# Altium schematic sheet S05.SchDoc: IEEE-1394/Ethernet FPGA Controller
size 381 x 254 mm; Revision: 3.2; SheetNumber: 5; SheetTotal: 10
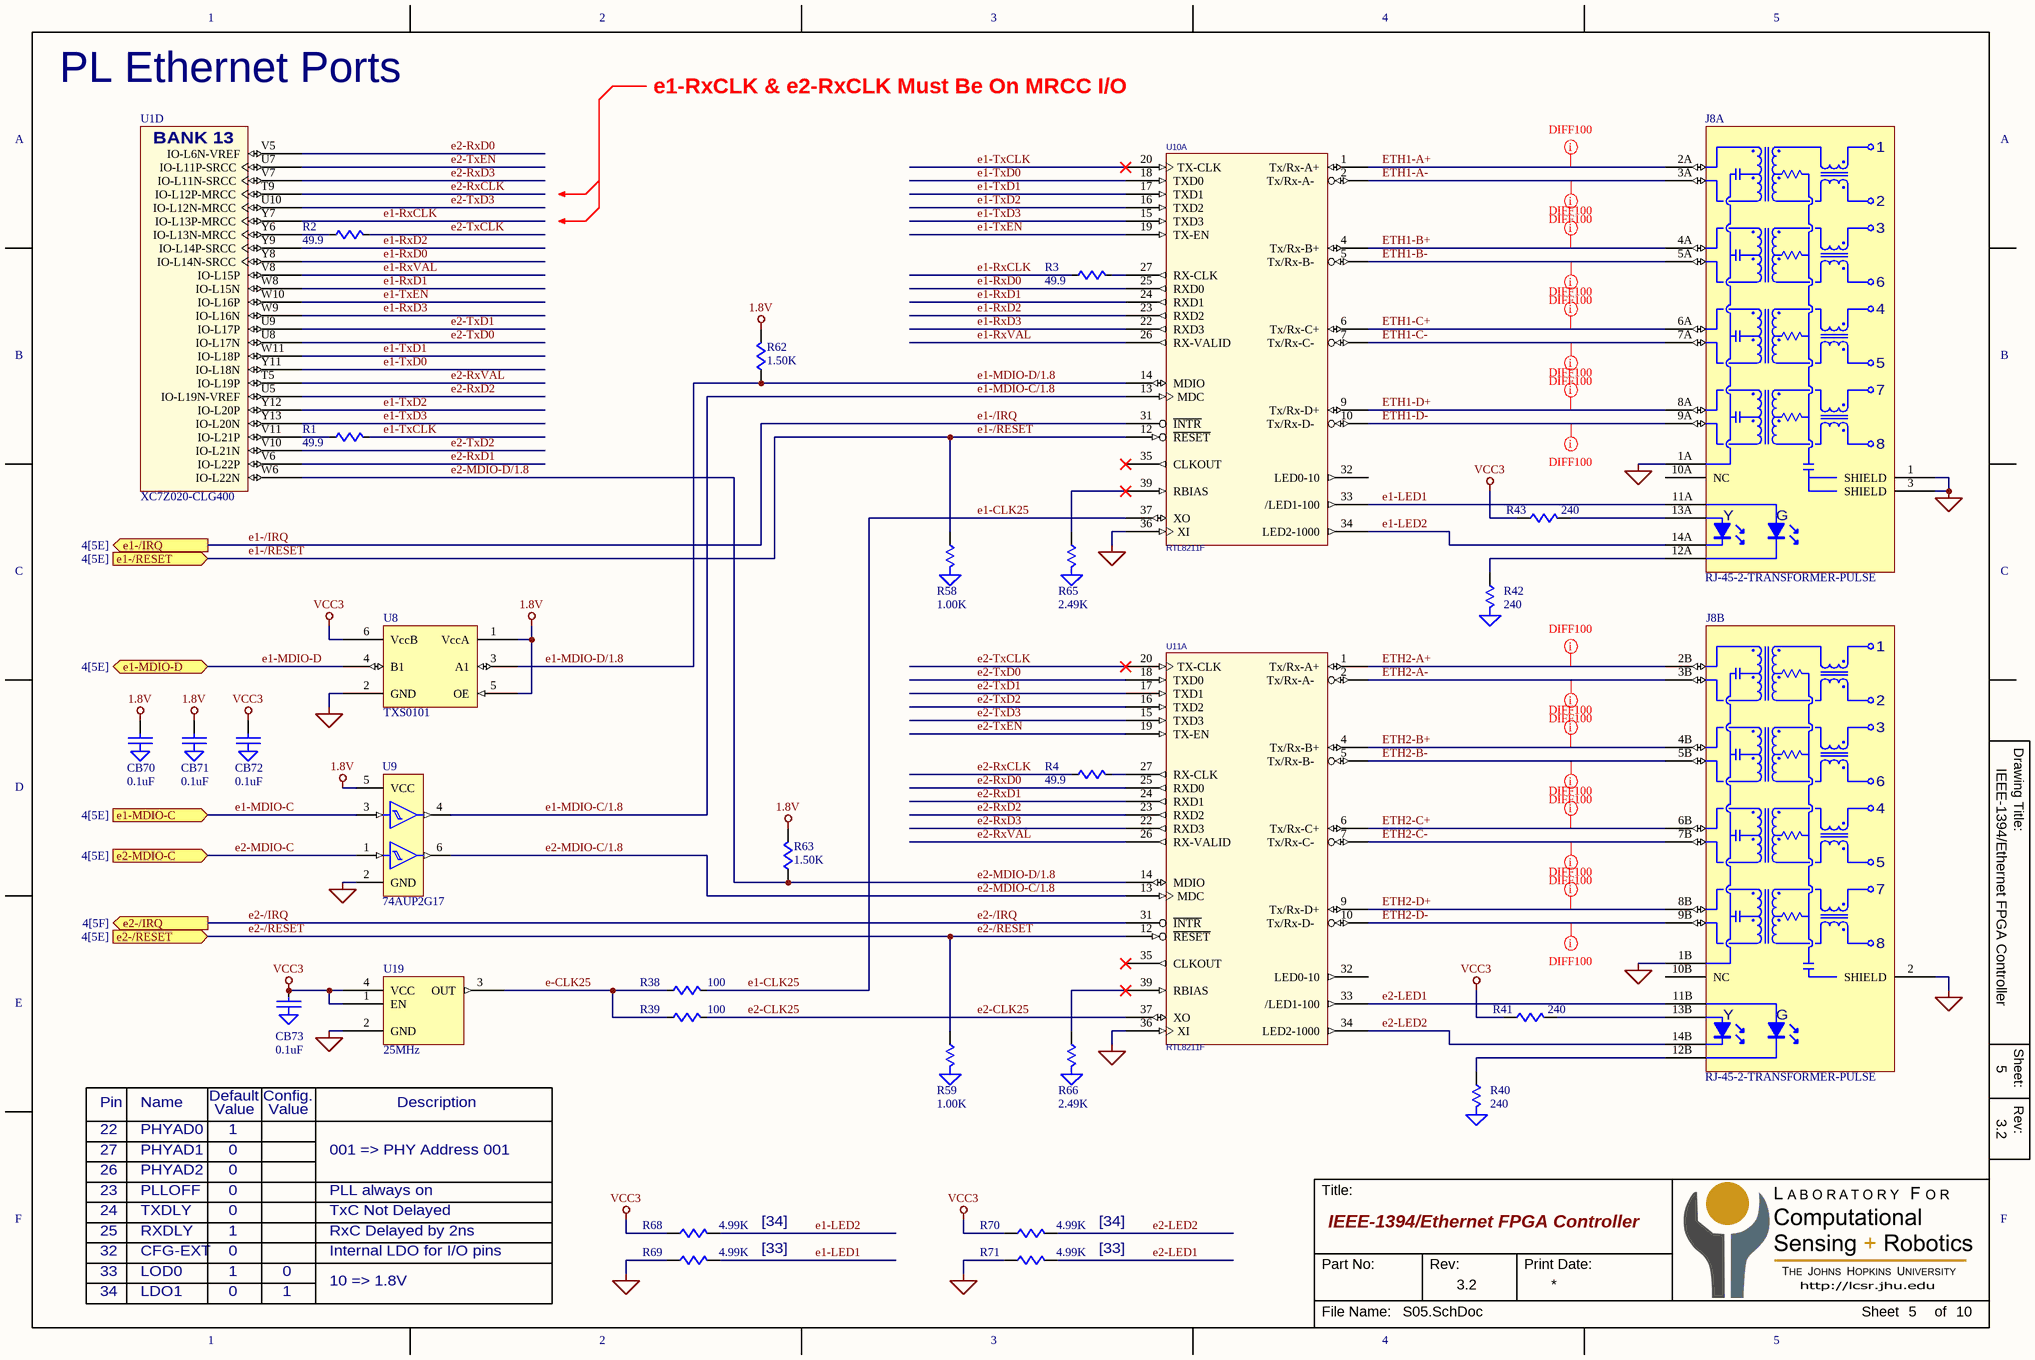
[diagram p0: S05.SchDoc]

## Parts
CB70  0.1uF  [C0201]
CB71  0.1uF  [C0201]
CB72  0.1uF  [C0201]
CB73  0.1uF  [C0201]
J8  RJ-45-2-TRANSFORMER-PULSE  [CONN-RJ-45-DUAL-PULSE-JXD0-2015NL]  (parts A,B of 2)
R1  49.9  [R0201]
R2  49.9  [R0201]
R3  49.9  [R0201]
R4  49.9  [R0201]
R38  100  [R0402]
R39  100  [R0402]
R40  240  [R0402]
R41  240  [R0402]
R42  240  [R0402]
R43  240  [R0402]
R58  1.00K  [R0402]
R59  1.00K  [R0402]
R62  1.50K  [R0402]
R63  1.50K  [R0402]
R65  2.49K  [R0402]
R66  2.49K  [R0402]
R68  4.99K  [R0402]
R69  4.99K  [R0402]
R70  4.99K  [R0402]
R71  4.99K  [R0402]
U1  XC7Z020-CLG400  [BGA-400-08mm]  (part D of 9)
U8  TXS0101  [SC70-6]
U9  74AUP2G17  [SC70-6]
U10  RTL8211F  [QFN-40-5MM]  (part A of 2)
U11  RTL8211F  [QFN-40-5MM]  (part A of 2)
U19  25MHz  [OSC-2x2.5mm]

## Ports
e1-/IRQ (out, see 4[5E]), e1-/RESET (in, see 4[5E]), e1-MDIO-C (in, see 4[5E]), e1-MDIO-D (bidir, see 4[5E]), e2-/IRQ (out, see 4[5F]), e2-/RESET (in, see 4[5E]), e2-MDIO-C (in, see 4[5E])

## Nets
1.8V: CB70.1 CB71.1 R62.2 R63.2 U8.1(VccA) U8.5(OE) U9.5(VCC)
GND: CB70.2(GND) CB71.2(GND) CB72.2(GND) CB73.2(GND) J8.1(SHIELD) J8.1A(GND) J8.1B(GND) J8.2(SHIELD) J8.3(SHIELD) R40.2(GND) R42.2(GND) R58.2(GND) R59.2(GND) R65.2(GND) R66.2(GND) R69.1 R71.1 U8.2(GND) U9.2(GND) U10.36(XI) U11.36(XI) U19.2(GND)
VCC3: CB72.1 CB73.1 R41.1 R43.1 R68.1 R70.1 U8.6(VccB) U19.1(EN) U19.4(VCC)
e1-/IRQ: U10.31(~{INTR}) ; port e1-/IRQ
e1-/RESET: R58.1 U10.12(~{RESET}) ; port e1-/RESET
e1-CLK25: R38.2 U10.37(XO)
e1-LED1: J8.11A(A(G)) R69.2 U10.33(/LED1-100)
e1-LED2: J8.14A(K(Y)) R68.2 U10.34(LED2-1000)
e1-MDIO-C: U9.3 ; port e1-MDIO-C
e1-MDIO-C/1.8: U9.4 U10.13(MDC)
e1-MDIO-D: U8.4(B1) ; port e1-MDIO-D
e1-MDIO-D/1.8: R62.1 U8.3(A1) U10.14(MDIO)
e1-RxCLK: R3.1 U1.Y7(IO-L13P-MRCC)
e1-RxD0: U1.Y8(IO-L14N-SRCC) U10.25(RXD0)
e1-RxD1: U1.W8(IO-L15N) U10.24(RXD1)
e1-RxD2: U1.Y9(IO-L14P-SRCC) U10.23(RXD2)
e1-RxD3: U1.W9(IO-L16N) U10.22(RXD3)
e1-RxVAL: U1.V8(IO-L15P) U10.26(RX-VALID)
e1-TxCLK: R1.2 U10.20(TX-CLK)
e1-TxD0: U1.Y11(IO-L18N) U10.18(TXD0)
e1-TxD1: U1.W11(IO-L18P) U10.17(TXD1)
e1-TxD2: U1.Y12(IO-L20P) U10.16(TXD2)
e1-TxD3: U1.Y13(IO-L20N) U10.15(TXD3)
e1-TxEN: U1.W10(IO-L16P) U10.19(TX-EN)
e2-/IRQ: U11.31(~{INTR}) ; port e2-/IRQ
e2-/RESET: R59.1 U11.12(~{RESET}) ; port e2-/RESET
e2-CLK25: R39.2 U11.37(XO)
e2-LED1: J8.11B(A(G)) R71.2 U11.33(/LED1-100)
e2-LED2: J8.14B(K(Y)) R70.2 U11.34(LED2-1000)
e2-MDIO-C: U9.1 ; port e2-MDIO-C
e2-MDIO-C/1.8: U9.6 U11.13(MDC)
e2-MDIO-D/1.8: R63.1 U1.W6(IO-L22N) U11.14(MDIO)
e2-RxCLK: R4.1 U1.T9(IO-L12P-MRCC)
e2-RxD0: U1.V5(IO-L6N-VREF) U11.25(RXD0)
e2-RxD1: U1.V6(IO-L22P) U11.24(RXD1)
e2-RxD2: U1.U5(IO-L19N-VREF) U11.23(RXD2)
e2-RxD3: U1.V7(IO-L11N-SRCC) U11.22(RXD3)
e2-RxVAL: U1.T5(IO-L19P) U11.26(RX-VALID)
e2-TxCLK: R2.2 U11.20(TX-CLK)
e2-TxD0: U1.U8(IO-L17N) U11.18(TXD0)
e2-TxD1: U1.U9(IO-L17P) U11.17(TXD1)
e2-TxD2: U1.V10(IO-L21N) U11.16(TXD2)
e2-TxD3: U1.U10(IO-L12N-MRCC) U11.15(TXD3)
e2-TxEN: U1.U7(IO-L11P-SRCC) U11.19(TX-EN)
e-CLK25: R38.1 R39.1 U19.3(OUT)
ETH1-A+: J8.2A(1P) U10.1(Tx/Rx-A+)
ETH1-A-: J8.3A(1N) U10.2(Tx/Rx-A-)
ETH1-B+: J8.4A(2P) U10.4(Tx/Rx-B+)
ETH1-B-: J8.5A(2N) U10.5(Tx/Rx-B-)
ETH1-C+: J8.6A(3P) U10.6(Tx/Rx-C+)
ETH1-C-: J8.7A(3N) U10.7(Tx/Rx-C-)
ETH1-D+: J8.8A(4P) U10.9(Tx/Rx-D+)
ETH1-D-: J8.9A(4N) U10.10(Tx/Rx-D-)
ETH2-A+: J8.2B(1P) U11.1(Tx/Rx-A+)
ETH2-A-: J8.3B(1N) U11.2(Tx/Rx-A-)
ETH2-B+: J8.4B(2P) U11.4(Tx/Rx-B+)
ETH2-B-: J8.5B(2N) U11.5(Tx/Rx-B-)
ETH2-C+: J8.6B(3P) U11.6(Tx/Rx-C+)
ETH2-C-: J8.7B(3N) U11.7(Tx/Rx-C-)
ETH2-D+: J8.8B(4P) U11.9(Tx/Rx-D+)
ETH2-D-: J8.9B(4N) U11.10(Tx/Rx-D-)
NetJ8_12A: J8.12A(K(G)) R42.1
NetJ8_12B: J8.12B(K(G)) R40.1
NetJ8_13A: J8.13A(A(Y)) R43.2
NetJ8_13B: J8.13B(A(Y)) R41.2
NetR1_1: R1.1 U1.V11(IO-L21P)
NetR2_1: R2.1 U1.Y6(IO-L13N-MRCC)
NetR3_2: R3.2 U10.27(RX-CLK)
NetR4_2: R4.2 U11.27(RX-CLK)
NetR65_1: R65.1 U10.39(RBIAS)
NetR66_1: R66.1 U11.39(RBIAS)

Not connected (* = marked no-connect by the designer): J8 10A(NC) 10B(NC); U10 32(LED0-10) 35(CLKOUT)*; U11 32(LED0-10) 35(CLKOUT)*

## Layout directives
net class DIFF100: ETH1-A+, ETH1-A-, ETH1-B+, ETH1-B-, ETH1-C+, ETH1-C-, ETH1-D+, ETH1-D-, ETH2-A+, ETH2-A-, ETH2-B+, ETH2-B-, ETH2-C+, ETH2-C-, ETH2-D+, ETH2-D-

## Notes on the sheet
- PL Ethernet Ports
- e1-RxCLK & e2-RxCLK Must Be On MRCC I/O
- Pin
- Name
- Default
- Value
- Config.
- Description
- 22
- 27
- 26
- PHYAD0
- PHYAD1
- PHYAD2
- 1
- 0
- 001 => PHY Address 001
- 23
- 24
- 25
- PLLOFF
- TXDLY
- RXDLY
- RxC Delayed by 2ns
- PLL always on
- TxC Not Delayed
- [34]
- 32
- 33
- 34
- LOD0
- LDO1
- CFG-EXT
- 10 => 1.8V
- Internal LDO for I/O pins
- [33]
- 2
- 3
- 4
- 5
- A
- B
- C
- Drawing Title:
- D
- E
- Sheet:
- Rev:
- F
- Title:
- Part No:
- Print Date:
- File Name:
- Sheet
- of
- (in symbol RJ-45-2-TRANSFORMER-PULSE, part A) 6; 4; 5; 7; 8; Y; G
- (in symbol RJ-45-2-TRANSFORMER-PULSE, part B) 6; 4; 5; 7; 8; Y; G
- (in symbol XC7Z020-CLG400, part D) BANK 13

## Library data of the parts
CB70-CB73 = CAP-GND
J8 = RJ-45-2-TRANSFORMER-PULSE: PULSE JXD0-2015NL
R1-R4 R38 R39 R41 R43 R62 R63 R68-R71 = R
R40 R42 R58 R59 R65 R66 = R-GND
U9 = 2G17-1: NC7WZ17
U10 U11 = RTL8211F: Ethernet PHY
U19 = OSCILATOR